# EAGLE design RGB-driver-v1 (EAGLE 7.1.0)
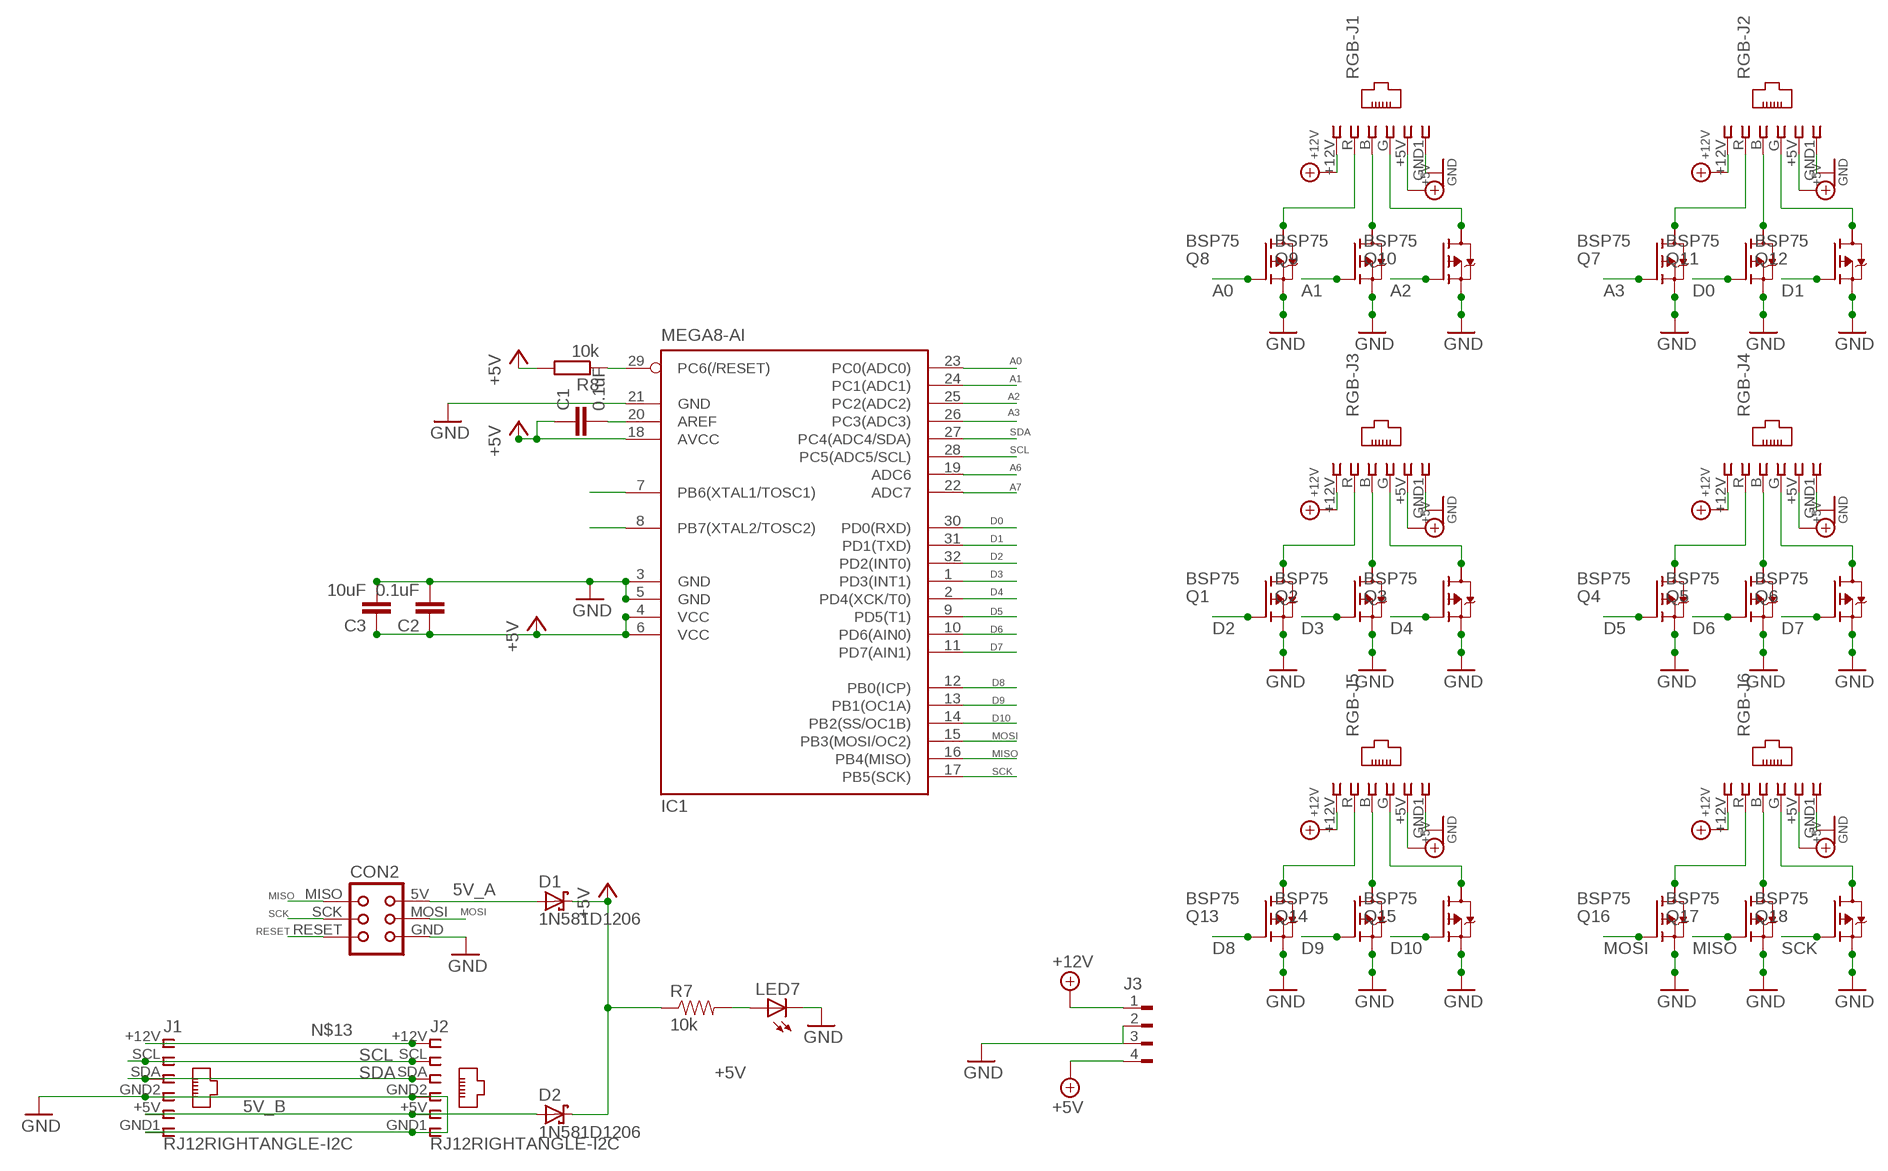
[diagram p0: schematic, sheet 1]

## Parts
C1  0.1uF  C-EUC1206  [C1206]
C2  0.1uF  C-EUC1206  [C1206]
C3  10uF  C-EUC1206  [C1206]
CON2  TINYISPTAG  [TC2030-MCP]
D1  1N581D1206  [LED-1206]
D2  1N581D1206  [LED-1206]
IC1  MEGA8-AI  [TQFP32-08]
J1  RJ12RIGHTANGLE-I2C  [RJ12-RIGHTANGLE-I2C]
J2  RJ12RIGHTANGLE-I2C  [RJ12-RIGHTANGLE-I2C]
J3  FLOP-4W827001  [827001]
LED7  LEDCHIP-LED0603  [CHIP-LED0603]
Q1  BSP75  BSP613P  [PG-SOT-223]
Q2  BSP75  BSP613P  [PG-SOT-223]
Q3  BSP75  BSP613P  [PG-SOT-223]
Q4  BSP75  BSP613P  [PG-SOT-223]
Q5  BSP75  BSP613P  [PG-SOT-223]
Q6  BSP75  BSP613P  [PG-SOT-223]
Q7  BSP75  BSP613P  [PG-SOT-223]
Q8  BSP75  BSP613P  [PG-SOT-223]
Q9  BSP75  BSP613P  [PG-SOT-223]
Q10  BSP75  BSP613P  [PG-SOT-223]
Q11  BSP75  BSP613P  [PG-SOT-223]
Q12  BSP75  BSP613P  [PG-SOT-223]
Q13  BSP75  BSP613P  [PG-SOT-223]
Q14  BSP75  BSP613P  [PG-SOT-223]
Q15  BSP75  BSP613P  [PG-SOT-223]
Q16  BSP75  BSP613P  [PG-SOT-223]
Q17  BSP75  BSP613P  [PG-SOT-223]
Q18  BSP75  BSP613P  [PG-SOT-223]
R7  10k  RESISTOR0603-RES  [0603-RES]
R8  10k  R-EU_M1206  [M1206]
RGB-J1  RJ12  RJ12STRAIGHT-RGB  [RJ12-STRAIGHT-RGB]
RGB-J2  RJ12  RJ12STRAIGHT-RGB  [RJ12-STRAIGHT-RGB]
RGB-J3  RJ12  RJ12STRAIGHT-RGB  [RJ12-STRAIGHT-RGB]
RGB-J4  RJ12  RJ12STRAIGHT-RGB  [RJ12-STRAIGHT-RGB]
RGB-J5  RJ12  RJ12STRAIGHT-RGB  [RJ12-STRAIGHT-RGB]
RGB-J6  RJ12  RJ12STRAIGHT-RGB  [RJ12-STRAIGHT-RGB]

## Nets
5V_A [i2c]: CON2.5V(VCC) D1.A
5V_B [power]: D2.A J1.+5V J2.+5V
+5V [power]: C1.1 C2.1 C3.1 D1.C D2.C IC1.4(VCC) IC1.6(VCC) IC1.18(AVCC) R7.1 R8.2
+12V_HP [power]: J3.1 RGB-J1.+12V RGB-J2.+12V RGB-J3.+12V RGB-J4.+12V RGB-J5.+12V RGB-J6.+12V ; supply symbol labelled +12V
A0: IC1.23(PC0(ADC0)) Q8.1(G)
A1: IC1.24(PC1(ADC1)) Q9.1(G)
A2: IC1.25(PC2(ADC2)) Q10.1(G)
A3: IC1.26(PC3(ADC3)) Q7.1(G)
A6: IC1.19(ADC6)
A7: IC1.22(ADC7)
D0: IC1.30(PD0(RXD)) Q11.1(G)
D1: IC1.31(PD1(TXD)) Q12.1(G)
D2: IC1.32(PD2(INT0)) Q1.1(G)
D3: IC1.1(PD3(INT1)) Q2.1(G)
D4: IC1.2(PD4(XCK/T0)) Q3.1(G)
D5: IC1.9(PD5(T1)) Q4.1(G)
D6: IC1.10(PD6(AIN0)) Q5.1(G)
D7: IC1.11(PD7(AIN1)) Q6.1(G)
D8: IC1.12(PB0(ICP)) Q13.1(G)
D9: IC1.13(PB1(OC1A)) Q14.1(G)
D10: IC1.14(PB2(SS/OC1B)) Q15.1(G)
MISO: CON2.MISO IC1.16(PB4(MISO)) Q17.1(G)
MOSI: CON2.MOSI IC1.15(PB3(MOSI/OC2)) Q16.1(G)
N$1 [aref]: Q2.2(D) RGB-J3.B
N$2 [aref]: Q1.2(D) RGB-J3.R
N$3 [aref]: Q3.2(D) RGB-J3.G
N$4: C1.2 IC1.20(AREF)
N$5 [aref]: Q5.2(D) RGB-J4.B
N$6 [aref]: Q10.2(D) RGB-J1.G
N$7 [aref]: Q4.2(D) RGB-J4.R
N$8 [aref]: Q6.2(D) RGB-J4.G
N$9 [aref]: Q14.2(D) RGB-J5.B
N$10 [aref]: Q11.2(D) RGB-J2.B
N$11 [aref]: Q13.2(D) RGB-J5.R
N$12 [aref]: Q15.2(D) RGB-J5.G
N$13: J1.+12V J2.+12V
N$14 [aref]: Q17.2(D) RGB-J6.B
N$15: LED7.A R7.2
N$16 [aref]: Q16.2(D) RGB-J6.R
N$17 [aref]: Q18.2(D) RGB-J6.G
N$20 [aref]: Q7.2(D) RGB-J2.R
N$22 [power]: C2.2 C3.2 CON2.GND IC1.3(GND) IC1.5(GND) IC1.21(GND) J1.GND1 J1.GND2 J2.GND1 J2.GND2 J3.2 J3.3 LED7.C Q1.3(S) Q2.3(S) Q3.3(S) Q4.3(S) Q5.3(S) Q6.3(S) Q7.3(S) Q8.3(S) Q9.3(S) Q10.3(S) Q11.3(S) Q12.3(S) Q13.3(S) Q14.3(S) Q15.3(S) Q16.3(S) Q17.3(S) Q18.3(S) RGB-J1.GND1 RGB-J2.GND1 RGB-J3.GND1 RGB-J4.GND1 RGB-J5.GND1 RGB-J6.GND1 ; supply symbol labelled GND
N$23 [aref]: Q12.2(D) RGB-J2.G
N$25 [power]: J3.4 RGB-J1.+5V RGB-J2.+5V RGB-J3.+5V RGB-J4.+5V RGB-J5.+5V RGB-J6.+5V ; supply symbol labelled +5V
N$50 [aref]: Q9.2(D) RGB-J1.B
N$68 [aref]: Q8.2(D) RGB-J1.R
PB6: IC1.7(PB6(XTAL1/TOSC1))
PB7: IC1.8(PB7(XTAL2/TOSC2))
RESET: CON2.RESET IC1.29(PC6(/RESET)) R8.1
SCK: CON2.SCK IC1.17(PB5(SCK)) Q18.1(G)
SCL [i2c]: IC1.28(PC5(ADC5/SCL)) J1.SCL J2.SCL
SDA [i2c]: IC1.27(PC4(ADC4/SDA)) J1.SDA J2.SDA
Unconnected: Q1.4(D) Q2.4(D) Q3.4(D) Q4.4(D) Q5.4(D) Q6.4(D) Q7.4(D) Q8.4(D) Q9.4(D) Q10.4(D) Q11.4(D) Q12.4(D) Q13.4(D) Q14.4(D) Q15.4(D) Q16.4(D) Q17.4(D) Q18.4(D)

## Library data of the parts
C1-C3 = resistor:C-EU: CAPACITOR, European symbol
CON2 = lpatiny:TINYISP: CONNECTOR
D1 D2 = lpatiny:1N581*: 1.0A SCHOTTKY BARRIER RECTIFIER Source: http://www.diodes.com/datasheets/ds23001.pdf
IC1 = atmel:MEGA8: MICROCONTROLLER 8 Kbytes FLASH, 1 kbytes SRAM, 512 bytes EEPROM, USART, 6-channel 10 bit ADC, 2-channel 8 bit ADC Pin compatible with Atmega48, ATMega88, ATMega168 Source: avr.lbr; MPN: ATMEGA8-16AU; OC_FARNELL: 9171371; OC_NEWARK: 73M8863
J1 J2 RGB-J1-RGB-J6 = lpatiny:RJ12: CORCOM Modular RJ Jacks No Shield Source: www.tycoelectronics.com .. ENG_DS_1654001_1099_RJ_L_0507.pdf
J3 = con-amp:FLOP-4W: MATE N-LOCK Floppy / HDD conector Distributor: Bürklin 71F972
LED7 = adafruit:LED: LED OSRAM: - CHIPLED LG R971, LG N971, LY N971, LG Q971, LY Q971, LO R971, LY R971 LH N974, LH R974 LS Q976, LO Q976, LY Q976 LO Q996 - Hyper CHIPLED LW Q18S LB Q993, LB Q99A, LB R99A - SideLED LS A670, LO A670, LY A670, LG A670, LP A670 LB A673, LV A673, LT A673, LW A673 LH A674 LY A675 LS A676, LA A676, LO A676, LY A676, LW A676 LS A679, LY A679, LG A679 - Hyper Micro SIDELED® LS Y876, LA Y876, LO Y876, LY Y876 LT Y87S - SmartLED LW L88C, LW L88S LB L89C, LB L89S, LG L890 LS L89K, LO L89K, LY L89K LS L896, LA L896, LO L896, LY L896 - TOPLED LS T670, LO T670, LY T670, LG T670, LP T670 LSG T670, LSP T670, LSY T670, LOP T670, LYG T670 LG T671, LOG T671, LSG T671 LB T673, LV T673, LT T673, LW T673 LH T674 LS T676, LA T676, LO T676, LY T676, LB T676, LH T676, LSB T676, LW T676 LB T67C, LV T67C, LT T67C, LS T67K, LO T67K, LY T67K, LW E67C LS E67B, LA E67B, LO E67B, LY E67B, LB E67C, LV E67C, LT E67C LW T67C LS T679, LY T679, LG T679 LS T770, LO T770, LY T770, LG T770, LP T770 LB T773, LV T773, LT T773, LW T773 LH T774 LS E675, LA E675, LY E675, LS T675 LS T776, LA T776, LO T776, LY T776, LB T776 LHGB T686 LT T68C, LB T68C - Hyper Mini TOPLED® LB M676 - Mini TOPLED Santana® LG M470 LS M47K, LO M47K, LY M47K Source: http://www.osram.convergy.de/
Q1-Q18 = infineon:BSP613P: SIPMOS (R) Small-Signal-Transistor P-Channel (2 Drain) Source: http://www.infineon.com/dgdl/BSP613P_Rev2.4.pdf; OC_FARNELL: unknown; OC_NEWARK: unknown
R7 = SparkFun:RESISTOR: Resistor Basic schematic elements and footprints for 0603, 1206, and PTH resistors.
R8 = resistor:R-EU_: RESISTOR, European symbol

## Net classes
0 default: width 0.406 mm
1 power: width 0.457 mm
2 i2c: width 0.457 mm
3 fine: width 0.305 mm
4 aref: width 0.406 mm

## Board
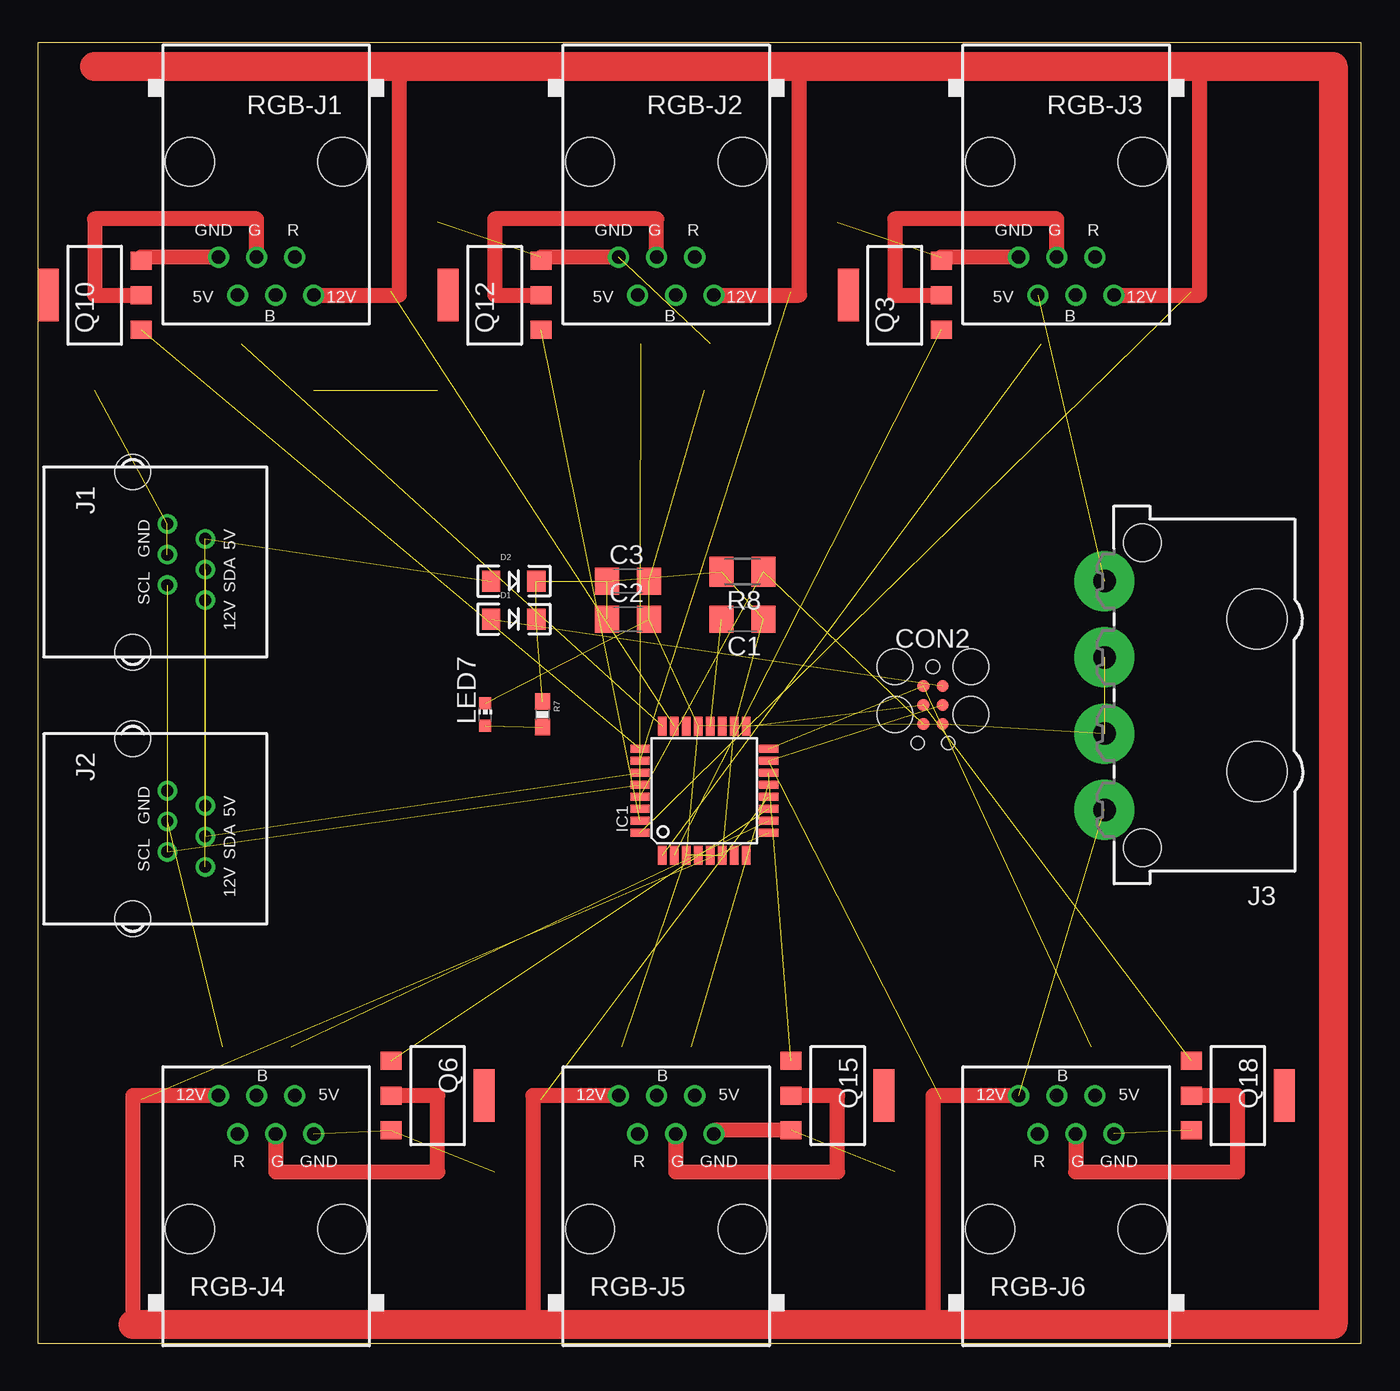
[diagram p1: board, top side]
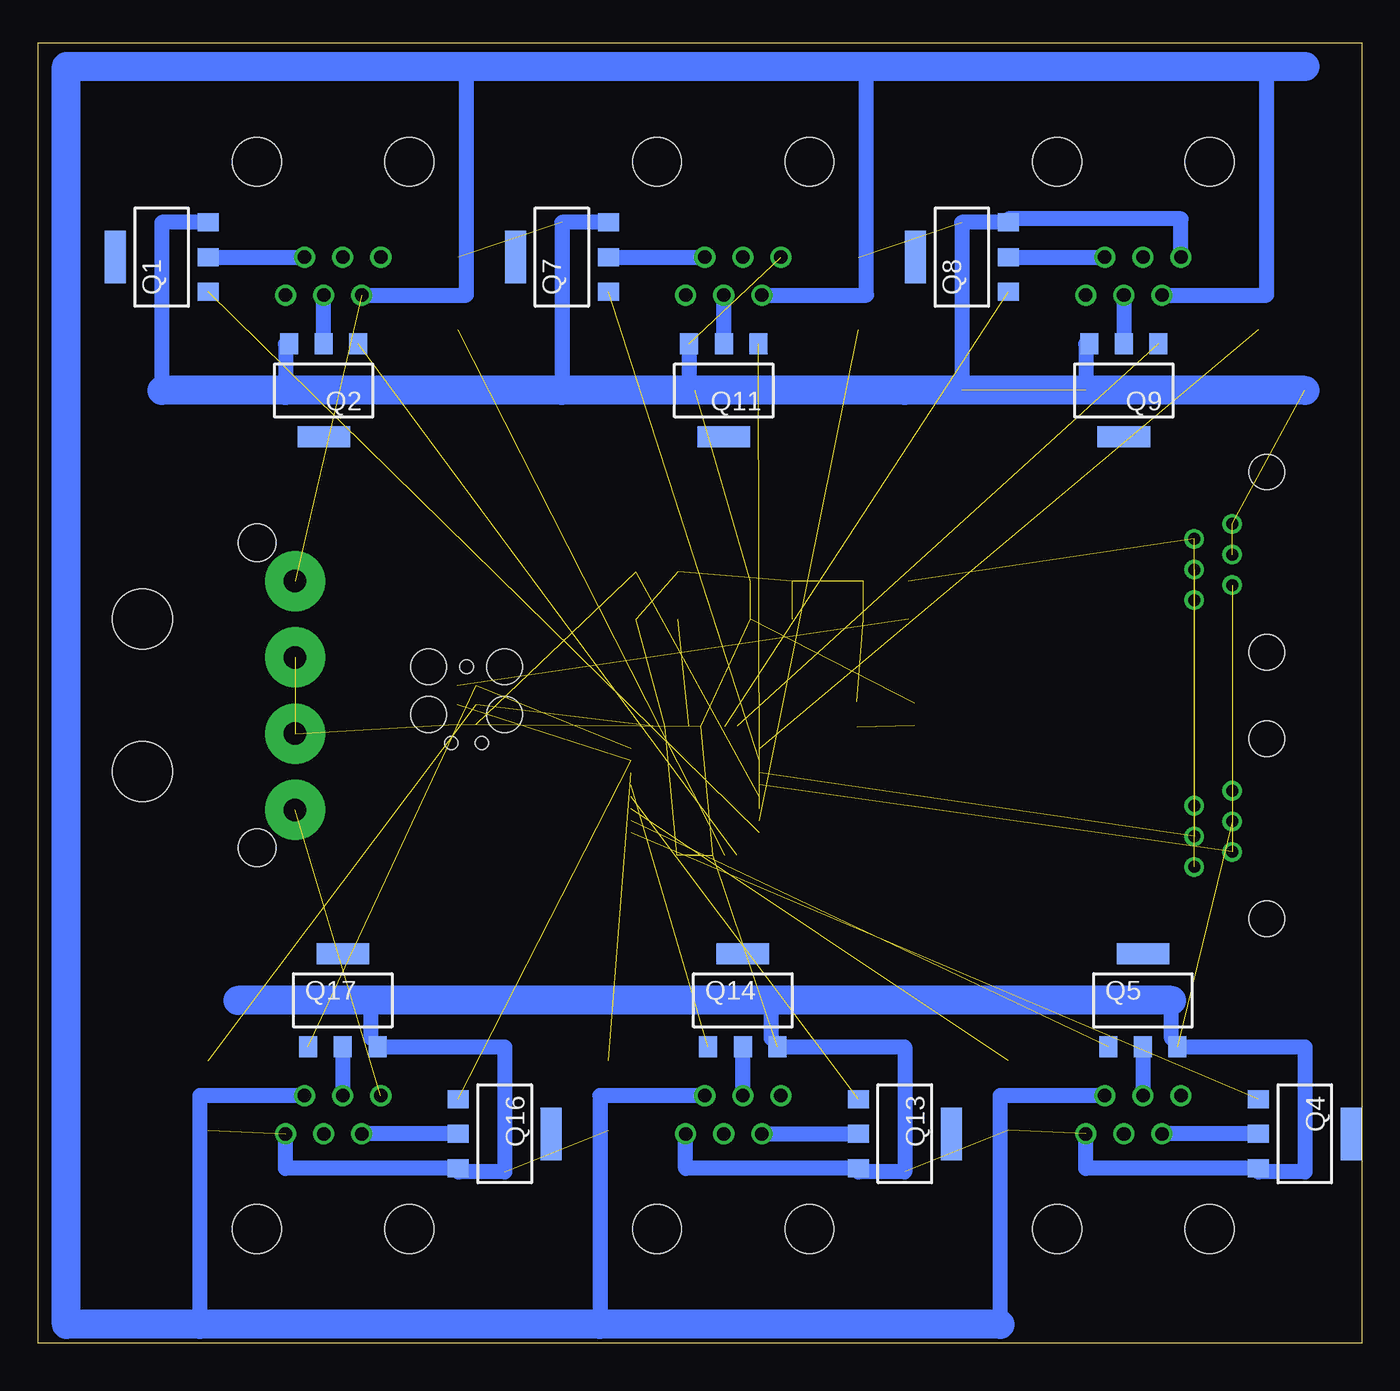
[diagram p2: board, bottom side, seen from below]

Size 88.25 x 86.67 mm. Coordinates in mm from the lower left corner, seen from the top.
Outline: 0,0 88.25,0 88.25,86.67 0,86.67 0,0
Copper layers (1*16): Top 0.035mm / dielectric 1.5mm / Bottom 0.035mm
Design rules "default": minimum track width 6mil, minimum drill 12mil, track to track 6mil, track to pad 6mil, pad to pad 6mil, via to via 6mil, smd to smd 0mil, copper to edge 10mil, drill to drill 10mil, minimum pad ring 10mil, minimum via ring 6mil, stop-mask expansion 2mil, vias tented up to drill 100mil, thermal gap 10mil
vRestrict: area 38.1,30.5 to 50.8,34.3; area 38.1,39.4 to 50.8,43.2; area 47,30.5 to 50.8,43.2; area 38.1,30.5 to 41.9,43.2; area 57.1,40.6 to 62.2,45.7

### Footprints (pad centres in the part's own frame; a part is rotated, then mirrored left to right if it is on the bottom)
C1206 = smd 1.6 x 1.8: 1 -1.4,0; 2 1.4,0
TC2030-MCP = smd 0.787 x 0.787: 5V 1.27,0.635; GND 3.81,0.635; MISO 1.27,-0.635; MOSI 2.54,0.635; RESET 3.81,-0.635; SCK 2.54,-0.635 | hole 0.889: 0,0; 5.08,-1.016; 5.08,1.016 | hole 2.375: 0,2.54; 0,-2.54; 3.175,-2.54; 3.175,2.54
LED-1206 = smd 1.2 x 1.4: A -1.5,0; C 1.5,0
TQFP32-08 = smd 1.27 x 0.559: 1 -4.293,2.8; 2 -4.293,2; 3 -4.293,1.2; 4 -4.293,0.4; 5 -4.293,-0.4; 6 -4.293,-1.2; 7 -4.293,-2; 8 -4.293,-2.8; 17 4.293,-2.8; 18 4.293,-2; 19 4.293,-1.2; 20 4.293,-0.4; 21 4.293,0.4; 22 4.293,1.2; 23 4.293,2; 24 4.293,2.8 | smd 0.559 x 1.27: 9 -2.8,-4.293; 10 -2,-4.293; 11 -1.2,-4.293; 12 -0.4,-4.293; 13 0.4,-4.293; 14 1.2,-4.293; 15 2,-4.293; 16 2.8,-4.293; 25 2.8,4.293; 26 2,4.293; 27 1.2,4.293; 28 0.4,4.293; 29 -0.4,4.293; 30 -1.2,4.293; 31 -2,4.293; 32 -2.8,4.293
RJ12-RIGHTANGLE-I2C = drill 0.8 pad 1.3: +5V -1.54,4.84; +12V 2.54,4.84; GND1 -2.54,2.3; GND2 -0.5,2.3; SCL 1.54,2.3; SDA 0.5,4.84 | hole 2.36: -6,0; 6,0
827001 = drill 1.5 pad 4: 1 -7.62,0; 2 -2.54,0; 3 2.54,0; 4 7.62,0 | hole 4: 5.08,-10.16; -5.08,-10.16 | hole 2.5: 10.16,-2.54; -10.16,-2.54
CHIP-LED0603 = smd 0.8 x 0.8: A 0,-0.75; C 0,0.75
PG-SOT-223 = smd 1.2 x 1.4: 1 -2.311,-3.099; 2 0,-3.099; 3 2.311,-3.099 | smd 3.5 x 1.4: 4 0,3.099
0603-RES = smd 1.1 x 1: 1 -0.85,0; 2 0.85,0
M1206 = smd 1.6 x 2: 1 -1.4,0; 2 1.4,0
RJ12-STRAIGHT-RGB = drill 0.9 pad 1.4: +5V 1.905,8.89; +12V -3.175,8.89; B -0.635,8.89; G 0.635,6.35; GND1 3.175,6.35; R -1.905,6.35 | hole 3.251: -5.08,0; 5.08,0

### Placement (x,y rotation side)
C1  46.99,48.26 180 top
C2  39.37,48.26 0 top
C3  39.37,50.8 0 top
CON2  59.69,45.09 270 top
D1  31.75,48.26 0 top
D2  31.75,50.8 0 top
IC1  44.45,36.83 90 top
J1  6.35,52.07 270 top
J2  6.35,34.29 270 top
J3  71.12,43.18 90 top
LED7  29.84,41.91 0 top
Q1  80.01,72.39 90 bottom
Q2  69.22,63.5 180 bottom
Q3  57.15,69.85 90 top
Q4  3.81,13.97 270 bottom
Q5  14.61,22.86 0 bottom
Q6  26.67,16.51 270 top
Q7  53.34,72.39 90 bottom
Q8  26.67,72.39 90 bottom
Q9  15.88,63.5 180 bottom
Q10  3.81,69.85 90 top
Q11  42.55,63.5 180 bottom
Q12  30.48,69.85 90 top
Q13  30.48,13.97 270 bottom
Q14  41.27,22.86 0 bottom
Q15  53.34,16.51 270 top
Q16  57.15,13.97 270 bottom
Q17  67.94,22.86 0 bottom
Q18  80.01,16.51 270 top
R7  33.66,41.91 270 top
R8  46.99,51.44 180 top
RGB-J1  15.24,78.74 180 top
RGB-J2  41.91,78.74 180 top
RGB-J3  68.58,78.74 180 top
RGB-J4  15.24,7.62 0 top
RGB-J5  41.91,7.62 0 top
RGB-J6  68.58,7.62 0 top

### Tracks (layer width: path | path; a pad name or v marks a point on that pad's centre or on a via)
5V_A  (1 unrouted)
5V_B  (2 unrouted)
+5V  (9 unrouted)
+12V_HP  (1 unrouted)
  Top 1.016: RGB-J1.+12V 24.13,69.85 24.13,85.09 | RGB-J2.+12V 50.8,69.85 50.8,85.09 | RGB-J3.+12V 77.47,69.85 77.47,85.09 | RGB-J4.+12V 6.35,16.51 6.35,1.27 | RGB-J5.+12V 33.02,16.51 33.02,1.27 | RGB-J6.+12V 59.69,16.51 59.69,1.27
  Top 1.93: 3.81,85.09 24.13,85.09 50.8,85.09 77.47,85.09 86.36,85.09 86.36,1.27 59.69,1.27 33.02,1.27 6.35,1.27
A0  (1 unrouted)
A1  (1 unrouted)
A2  (1 unrouted)
A3  (1 unrouted)
D0  (1 unrouted)
D1  (1 unrouted)
D2  (1 unrouted)
D3  (1 unrouted)
D4  (1 unrouted)
D5  (1 unrouted)
D6  (1 unrouted)
D7  (1 unrouted)
D8  (1 unrouted)
D9  (1 unrouted)
D10  (1 unrouted)
MISO  (2 unrouted)
MOSI  (2 unrouted)
N$1
  Bottom 1.016: Q2.2 RGB-J3.B
N$2
  Bottom 1.016: Q1.2 RGB-J3.R
N$3
  Top 1.016: RGB-J3.G 67.94,74.93 57.15,74.93 57.15,69.85 Q3.2
N$4  (1 unrouted)
N$5
  Bottom 1.016: Q5.2 RGB-J4.B
N$6
  Top 1.016: RGB-J1.G 14.61,74.93 3.81,74.93 3.81,69.85 Q10.2
N$7
  Bottom 1.016: Q4.2 RGB-J4.R
N$8
  Top 1.016: RGB-J4.G 15.88,11.43 26.67,11.43 26.67,16.51 Q6.2
N$9
  Bottom 1.016: RGB-J5.B Q14.2
N$10
  Bottom 1.016: Q11.2 RGB-J2.B
N$11
  Bottom 1.016: RGB-J5.R Q13.2
N$12
  Top 1.016: RGB-J5.G 42.55,11.43 53.34,11.43 53.34,16.51 Q15.2
N$13  (1 unrouted)
N$14
  Bottom 1.016: Q17.2 RGB-J6.B
N$15  (1 unrouted)
N$16
  Bottom 1.016: Q16.2 RGB-J6.R
N$17
  Top 1.016: RGB-J6.G 69.22,11.43 80.01,11.43 80.01,16.51 Q18.2
N$18
  Bottom 1.016: 12.7,20.32 12.7,22.86
  Bottom 1.93: 12.7,22.86 74.93,22.86
N$19
  Bottom 1.016: 39.37,20.32 39.37,22.86
N$20
  Bottom 1.016: Q7.2 RGB-J2.R
N$21
  Bottom 1.016: 66.04,20.32 66.04,22.86
N$22  (22 unrouted)
  Top 1.016: Q15.3 45.09,14.2 RGB-J5.GND1 | RGB-J1.GND1 6.91,72.39 Q10.3 | RGB-J2.GND1 33.58,72.39 Q12.3 | RGB-J3.GND1 60.25,72.39 Q3.3
  Bottom 0.406: 33.58,11.43 Q13.3
  Bottom 1.016: Q13.3 45.09,11.66 RGB-J5.GND1 | Q14.3 30.48,19.76 30.48,11.43 33.58,11.43 | RGB-J4.GND1 18.41,11.66 Q4.3 6.91,11.43 3.81,11.43 3.81,19.76 Q5.3 | RGB-J6.GND1 71.75,11.66 Q16.3 60.25,11.43 57.15,11.43 57.15,19.76 Q17.3 | RGB-J1.GND1 12.06,74.93 23.57,74.93 Q8.3 26.67,74.7 26.67,63.5 30.48,63.5 | Q9.3 18.41,66.6 18.41,63.5 17.78,63.5 | Q11.3 44.86,63.91 44.45,63.5 | Q7.3 53.34,74.7 53.34,63.5 | Q2.3 71.75,66.6 71.75,63.5 | Q1.3 80.01,74.7 80.01,63.5
  Bottom 1.93: 3.81,63.5 30.48,63.5 53.34,63.5 71.75,63.5 80.01,63.5
N$23
  Top 1.016: RGB-J2.G 41.27,74.93 30.48,74.93 30.48,69.85 Q12.2
N$25  (1 unrouted)
  Bottom 1.016: RGB-J1.+5V 6.35,69.85 6.35,85.09 | RGB-J2.+5V 33.02,69.85 33.02,85.09 | RGB-J3.+5V 59.69,69.85 59.69,85.09 | RGB-J6.+5V 77.47,16.51 77.47,1.27 | RGB-J5.+5V 50.8,16.51 50.8,1.27 | RGB-J4.+5V 24.13,16.51 24.13,1.27
  Bottom 1.93: 24.13,1.27 50.8,1.27 77.47,1.27 86.36,1.27 86.36,85.09 59.69,85.09 33.02,85.09 6.35,85.09 3.81,85.09
N$50
  Bottom 1.016: RGB-J1.B Q9.2
N$68
  Bottom 1.016: Q8.2 RGB-J1.R
RESET  (2 unrouted)
SCK  (2 unrouted)
SCL  (2 unrouted)
SDA  (2 unrouted)